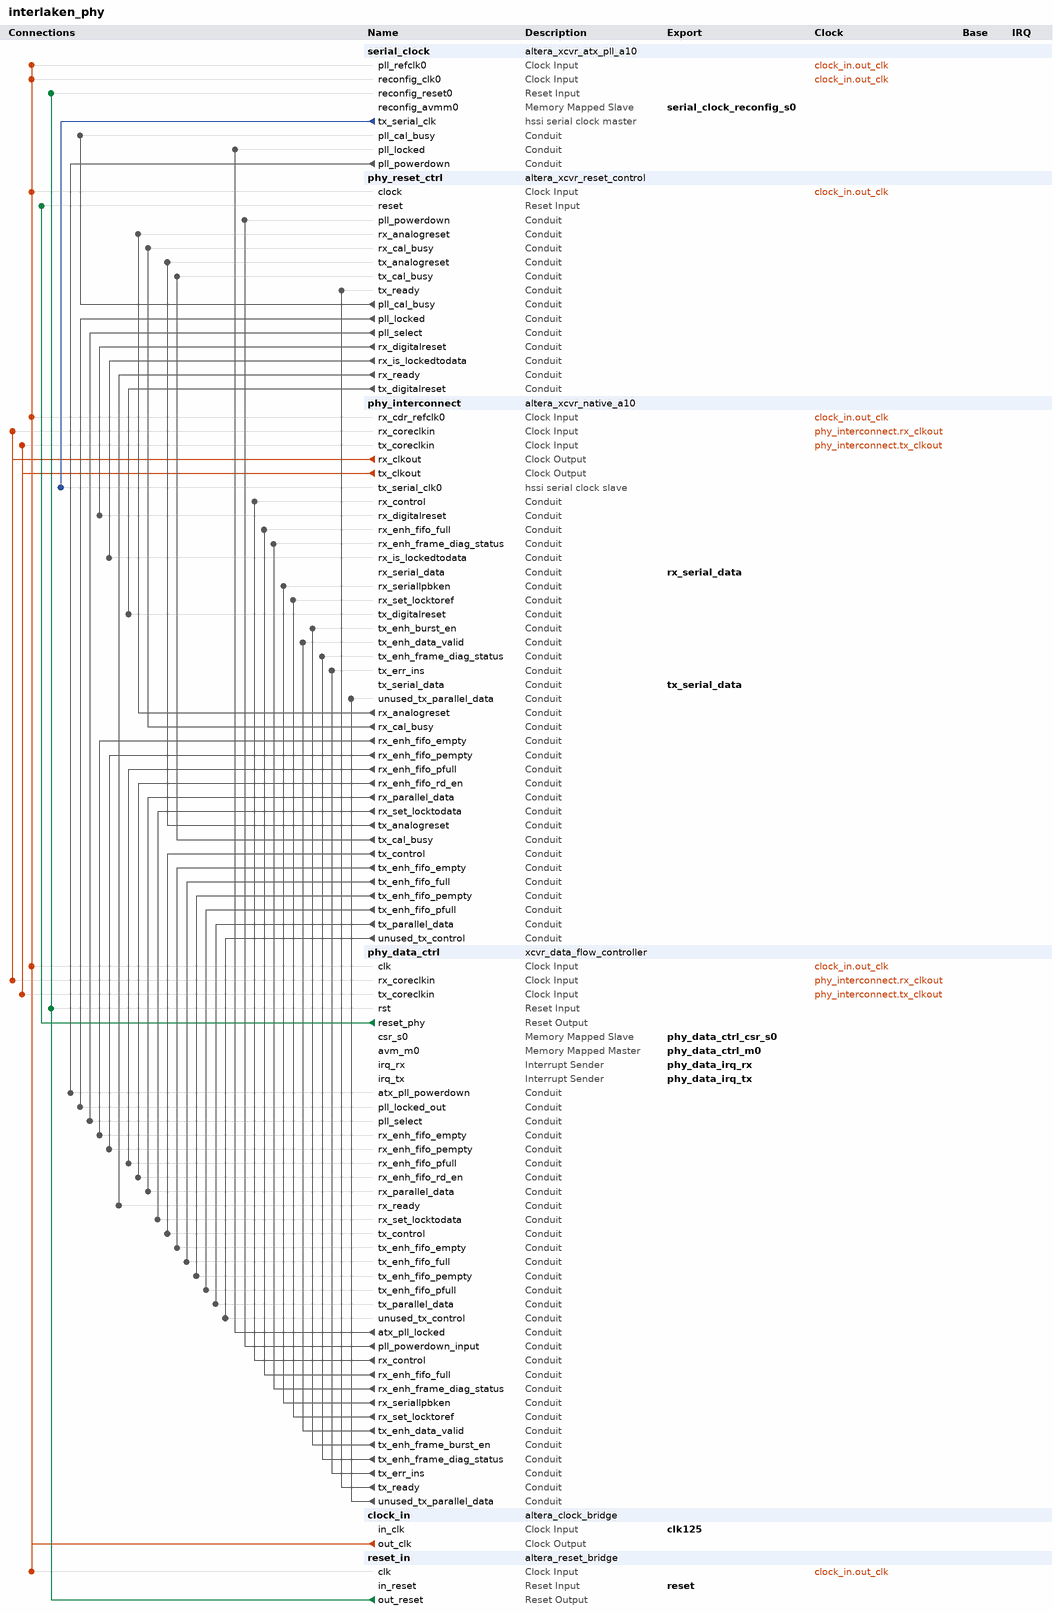
[diagram p0: system contents]
# Platform Designer (Qsys) system interlaken_phy, Cyclone 10 GX 10CX220YF780I5G
# Parameters at their usual value, and those the tool derives, are not listed.
package require -exact qsys 1.0
create_system interlaken_phy
set_project_property DEVICE_FAMILY {Cyclone 10 GX}
set_project_property DEVICE 10CX220YF780I5G

add_component serial_clock ip/interlaken_phy/interlaken_phy_xcvr_atx_pll_a10_0.ip altera_xcvr_atx_pll_a10 serial_clock 18.1

add_component phy_reset_ctrl ip/interlaken_phy/interlaken_phy_xcvr_reset_control_0.ip altera_xcvr_reset_control phy_reset_ctrl 18.1

add_component phy_interconnect ip/interlaken_phy/interlaken_phy_xcvr_native_a10_0.ip altera_xcvr_native_a10 phy_interconnect 18.1
load_component phy_interconnect
set_component_parameter_value device_family {Cyclone 10 GX}
set_component_parameter_value base_device NIGHTFURY1
set_component_parameter_value design_environment QSYS
set_component_parameter_value device_revision 20nm1
set_component_parameter_value anlg_voltage 0_9V
set_component_parameter_value protocol_mode interlaken_mode
set_component_parameter_value channels 1
set_component_parameter_value set_data_rate 1500
set_component_parameter_value rcfg_iface_enable 0
set_component_parameter_value enable_simple_interface 1
set_component_parameter_value enable_calibration 1
set_component_parameter_value set_disconnect_analog_resets 0
set_component_parameter_value enable_analog_resets 1
set_component_parameter_value enable_reset_sequence 1
set_component_parameter_value enable_upi_pipeline_options 0
set_component_parameter_value pcs_tx_delay1_ctrl delay1_path0
set_component_parameter_value pcs_tx_delay1_data_sel one_ff_delay
set_component_parameter_value pcs_tx_delay2_ctrl delay2_path0
set_component_parameter_value bonded_mode not_bonded
set_component_parameter_value pcs_bonding_master 0
set_component_parameter_value enable_port_tx_analog_reset_ack 0
set_component_parameter_value enable_port_tx_pma_clkout 0
set_component_parameter_value enable_port_tx_pma_div_clkout 0
set_component_parameter_value tx_pma_div_clkout_divider 0
set_component_parameter_value enable_port_rx_seriallpbken_tx 1
set_component_parameter_value set_cdr_refclk_freq 125.000
set_component_parameter_value enable_port_rx_analog_reset_ack 0
set_component_parameter_value enable_port_rx_pma_clkout 0
set_component_parameter_value enable_port_rx_pma_div_clkout 0
set_component_parameter_value rx_pma_div_clkout_divider 0
set_component_parameter_value enable_ports_rx_manual_cdr_mode 1
set_component_parameter_value std_pcs_pma_width 10
set_component_parameter_value display_std_tx_pld_pcs_width 10
set_component_parameter_value display_std_rx_pld_pcs_width 10
set_component_parameter_value enable_skp_ports 0
set_component_parameter_value hip_cal_en disable
set_component_parameter_value enable_pcie_data_mask_option 0
set_component_parameter_value std_data_mask_count_multi 0
set_component_parameter_value std_tx_byte_ser_mode Disabled
set_component_parameter_value std_rx_byte_deser_mode Disabled
set_component_parameter_value std_tx_8b10b_enable 0
set_component_parameter_value std_rx_8b10b_enable 0
set_component_parameter_value std_rx_word_aligner_mode bitslip
set_component_parameter_value std_rx_word_aligner_pattern_len 7
set_component_parameter_value enable_port_rx_std_bitslip 0
set_component_parameter_value std_tx_polinv_enable 0
set_component_parameter_value enable_port_tx_polinv 0
set_component_parameter_value std_rx_polinv_enable 0
set_component_parameter_value enable_port_rx_polinv 0
set_component_parameter_value enh_pcs_pma_width 40
set_component_parameter_value enh_pld_pcs_width 67
set_component_parameter_value enh_txfifo_mode Interlaken
set_component_parameter_value enable_port_tx_enh_fifo_full 1
set_component_parameter_value enable_port_tx_enh_fifo_pfull 1
set_component_parameter_value enable_port_tx_enh_fifo_empty 1
set_component_parameter_value enable_port_tx_enh_fifo_pempty 1
set_component_parameter_value enh_rxfifo_mode Interlaken
set_component_parameter_value enable_port_rx_enh_data_valid 0
set_component_parameter_value enable_port_rx_enh_fifo_full 1
set_component_parameter_value enable_port_rx_enh_fifo_pfull 1
set_component_parameter_value enable_port_rx_enh_fifo_empty 1
set_component_parameter_value enable_port_rx_enh_fifo_pempty 1
set_component_parameter_value enable_port_rx_enh_fifo_rd_en 1
set_component_parameter_value enh_tx_frmgen_enable 1
set_component_parameter_value enh_tx_frmgen_mfrm_length 5
set_component_parameter_value enh_tx_frmgen_burst_enable 1
set_component_parameter_value enable_port_tx_enh_frame_diag_status 1
set_component_parameter_value enable_port_tx_enh_frame_burst_en 1
set_component_parameter_value enh_rx_frmsync_enable 1
set_component_parameter_value enh_rx_frmsync_mfrm_length 5
set_component_parameter_value enable_port_rx_enh_frame_diag_status 1
set_component_parameter_value enh_tx_crcgen_enable 1
set_component_parameter_value enh_tx_crcerr_enable 1
set_component_parameter_value enh_rx_crcchk_enable 1
set_component_parameter_value enable_port_rx_enh_clr_errblk_count 0
set_component_parameter_value enable_port_rx_enh_clr_errblk_count_c10 0
set_component_parameter_value enh_tx_scram_enable 1
set_component_parameter_value enh_tx_scram_seed 81985529216486895
set_component_parameter_value enh_rx_descram_enable 1
set_component_parameter_value enh_tx_dispgen_enable 1
set_component_parameter_value enh_rx_dispchk_enable 1
set_component_parameter_value enh_rx_blksync_enable 1
set_component_parameter_value enable_port_rx_enh_blk_lock 0
set_component_parameter_value enable_port_rx_enh_bitslip 0
set_component_parameter_value generate_docs 0
set_component_parameter_value generate_add_hdl_instance_example 0
set_component_parameter_value enable_advanced_options 0
set_component_parameter_value enable_physical_bonding_clocks 0
set_component_parameter_value enable_debug_options 0
set_component_parameter_value enable_advanced_avmm_options 0
set_component_parameter_value enable_odi_accelerator 0
set_component_parameter_value enable_advanced_upi_options 0
set_component_parameter_value l_channels 1
set_component_parameter_value tx_enable 1
set_component_parameter_value datapath_select Enhanced
set_component_parameter_value rx_enable 1
set_component_parameter_value l_split_iface 0
set_component_parameter_value l_pcs_pma_width 40
set_component_parameter_value l_tx_pld_pcs_width 67
set_component_parameter_value l_rx_pld_pcs_width 67
set_component_parameter_value l_pll_settings_key 125.000000
set_component_parameter_value l_enable_pma_bonding 0
set_component_parameter_value l_enable_reve_support 0
set_component_parameter_value enable_std 0
set_component_parameter_value l_enable_std_pipe 0
set_component_parameter_value l_enable_tx_std 0
set_component_parameter_value l_enable_rx_std 0
set_component_parameter_value l_enable_tx_std_iface 0
set_component_parameter_value l_enable_rx_std_iface 0
set_component_parameter_value l_std_tx_word_count 1
set_component_parameter_value l_std_tx_word_width 10
set_component_parameter_value l_std_tx_field_width 11
set_component_parameter_value l_std_rx_word_count 1
set_component_parameter_value l_std_rx_word_width 10
set_component_parameter_value l_std_rx_field_width 16
set_component_parameter_value l_std_tx_pld_pcs_width 10
set_component_parameter_value l_std_rx_pld_pcs_width 10
set_component_parameter_value l_std_data_mask_count_multi 0
set_component_parameter_value enable_enh 1
set_component_parameter_value l_enable_tx_enh 1
set_component_parameter_value l_enable_rx_enh 1
set_component_parameter_value l_enable_tx_enh_iface 1
set_component_parameter_value l_enable_rx_enh_iface 1
set_component_parameter_value enable_pcs_dir 0
set_component_parameter_value l_enable_tx_pcs_dir 0
set_component_parameter_value l_enable_rx_pcs_dir 0
set_component_parameter_value l_rcfg_ifaces 1
set_component_parameter_value l_rcfg_addr_bits 10
set_component_parameter_value is_c10 1
set_component_parameter_value rcfg_enable 0
set_component_parameter_value rcfg_shared 0
set_component_parameter_value rcfg_jtag_enable 0
set_component_parameter_value rcfg_separate_avmm_busy 0
set_component_parameter_value adme_prot_mode interlaken_mode
set_component_parameter_value adme_pma_mode basic
set_component_parameter_value adme_tx_power_mode low_power
set_component_parameter_value adme_data_rate 1500000000
set_component_parameter_value enable_pcie_dfe_ip false
set_component_parameter_value sim_reduced_counters false
set_component_parameter_value disable_continuous_dfe false
set_component_parameter_value set_capability_reg_enable 0
set_component_parameter_value set_csr_soft_logic_enable 0
set_component_parameter_value set_prbs_soft_logic_enable 0
set_component_parameter_value set_odi_soft_logic_enable 0
set_component_parameter_value dbg_embedded_debug_enable 0
set_component_parameter_value dbg_capability_reg_enable 0
set_component_parameter_value dbg_user_identifier 0
set_component_parameter_value dbg_stat_soft_logic_enable 0
set_component_parameter_value dbg_ctrl_soft_logic_enable 0
set_component_parameter_value dbg_prbs_soft_logic_enable 0
set_component_parameter_value dbg_odi_soft_logic_enable 0
set_component_parameter_value rcfg_file_prefix altera_xcvr_native_a10
set_component_parameter_value rcfg_sv_file_enable 0
set_component_parameter_value rcfg_h_file_enable 0
set_component_parameter_value rcfg_mif_file_enable 0
set_component_parameter_value rcfg_multi_enable 0
set_component_parameter_value rcfg_emb_strm_enable 0
set_component_parameter_value rcfg_reduced_files_enable 0
set_component_parameter_value rcfg_profile_cnt 2
set_component_parameter_value rcfg_profile_select 1
set_component_parameter_value l_rcfg_datapath_message 0
set_component_parameter_value l_anlg_tx_enable 0
set_component_parameter_value l_anlg_rx_enable 0
set_component_parameter_value hssi_gen3_rx_pcs_block_sync bypass_block_sync
set_component_parameter_value hssi_gen3_rx_pcs_block_sync_sm disable_blk_sync_sm
set_component_parameter_value hssi_gen3_rx_pcs_cdr_ctrl_force_unalgn disable
set_component_parameter_value hssi_gen3_rx_pcs_lpbk_force lpbk_frce_dis
set_component_parameter_value hssi_gen3_rx_pcs_mode disable_pcs
set_component_parameter_value hssi_gen3_rx_pcs_rate_match_fifo bypass_rm_fifo
set_component_parameter_value hssi_gen3_rx_pcs_rate_match_fifo_latency low_latency
set_component_parameter_value hssi_gen3_rx_pcs_reverse_lpbk rev_lpbk_dis
set_component_parameter_value hssi_gen3_rx_pcs_rx_b4gb_par_lpbk b4gb_par_lpbk_dis
set_component_parameter_value hssi_gen3_rx_pcs_rx_force_balign dis_force_balign
set_component_parameter_value hssi_gen3_rx_pcs_rx_ins_del_one_skip ins_del_one_skip_dis
set_component_parameter_value hssi_gen3_rx_pcs_rx_num_fixed_pat 0
set_component_parameter_value hssi_gen3_rx_pcs_rx_test_out_sel rx_test_out0
set_component_parameter_value hssi_gen3_rx_pcs_sup_mode user_mode
set_component_parameter_value hssi_gen3_rx_pcs_silicon_rev 20nm5es
set_component_parameter_value hssi_gen3_rx_pcs_reconfig_settings {{}}
set_component_parameter_value hssi_gen3_tx_pcs_mode disable_pcs
set_component_parameter_value hssi_gen3_tx_pcs_reverse_lpbk rev_lpbk_dis
set_component_parameter_value hssi_gen3_tx_pcs_sup_mode user_mode
set_component_parameter_value hssi_gen3_tx_pcs_tx_bitslip 0
set_component_parameter_value hssi_gen3_tx_pcs_tx_gbox_byp bypass_gbox
set_component_parameter_value hssi_gen3_tx_pcs_silicon_rev 20nm5es
set_component_parameter_value hssi_krfec_rx_pcs_blksync_cor_en detect
set_component_parameter_value hssi_krfec_rx_pcs_bypass_gb bypass_dis
set_component_parameter_value hssi_krfec_rx_pcs_clr_ctrl both_enabled
set_component_parameter_value hssi_krfec_rx_pcs_ctrl_bit_reverse ctrl_bit_reverse_en
set_component_parameter_value hssi_krfec_rx_pcs_data_bit_reverse data_bit_reverse_dis
set_component_parameter_value hssi_krfec_rx_pcs_dv_start with_blklock
set_component_parameter_value hssi_krfec_rx_pcs_err_mark_type err_mark_10g
set_component_parameter_value hssi_krfec_rx_pcs_error_marking_en err_mark_dis
set_component_parameter_value hssi_krfec_rx_pcs_low_latency_en disable
set_component_parameter_value hssi_krfec_rx_pcs_lpbk_mode lpbk_dis
set_component_parameter_value hssi_krfec_rx_pcs_parity_invalid_enum 8
set_component_parameter_value hssi_krfec_rx_pcs_parity_valid_num 4
set_component_parameter_value hssi_krfec_rx_pcs_pipeln_blksync enable
set_component_parameter_value hssi_krfec_rx_pcs_pipeln_descrm disable
set_component_parameter_value hssi_krfec_rx_pcs_pipeln_errcorrect disable
set_component_parameter_value hssi_krfec_rx_pcs_pipeln_errtrap_ind enable
set_component_parameter_value hssi_krfec_rx_pcs_pipeln_errtrap_lfsr disable
set_component_parameter_value hssi_krfec_rx_pcs_pipeln_errtrap_loc disable
set_component_parameter_value hssi_krfec_rx_pcs_pipeln_errtrap_pat disable
set_component_parameter_value hssi_krfec_rx_pcs_pipeln_gearbox enable
set_component_parameter_value hssi_krfec_rx_pcs_pipeln_syndrm enable
set_component_parameter_value hssi_krfec_rx_pcs_pipeln_trans_dec disable
set_component_parameter_value hssi_krfec_rx_pcs_prot_mode disable_mode
set_component_parameter_value hssi_krfec_rx_pcs_receive_order receive_lsb
set_component_parameter_value hssi_krfec_rx_pcs_rx_testbus_sel overall
set_component_parameter_value hssi_krfec_rx_pcs_signal_ok_en sig_ok_en
set_component_parameter_value hssi_krfec_rx_pcs_sup_mode user_mode
set_component_parameter_value hssi_krfec_rx_pcs_silicon_rev 20nm5es
set_component_parameter_value hssi_krfec_rx_pcs_reconfig_settings {{}}
set_component_parameter_value hssi_krfec_tx_pcs_burst_err burst_err_dis
set_component_parameter_value hssi_krfec_tx_pcs_burst_err_len burst_err_len1
set_component_parameter_value hssi_krfec_tx_pcs_ctrl_bit_reverse ctrl_bit_reverse_en
set_component_parameter_value hssi_krfec_tx_pcs_data_bit_reverse data_bit_reverse_dis
set_component_parameter_value hssi_krfec_tx_pcs_enc_frame_query enc_query_dis
set_component_parameter_value hssi_krfec_tx_pcs_low_latency_en disable
set_component_parameter_value hssi_krfec_tx_pcs_pipeln_encoder enable
set_component_parameter_value hssi_krfec_tx_pcs_pipeln_scrambler enable
set_component_parameter_value hssi_krfec_tx_pcs_prot_mode disable_mode
set_component_parameter_value hssi_krfec_tx_pcs_sup_mode user_mode
set_component_parameter_value hssi_krfec_tx_pcs_transcode_err trans_err_dis
set_component_parameter_value hssi_krfec_tx_pcs_transmit_order transmit_lsb
set_component_parameter_value hssi_krfec_tx_pcs_tx_testbus_sel overall
set_component_parameter_value hssi_krfec_tx_pcs_silicon_rev 20nm5es
set_component_parameter_value hssi_10g_rx_pcs_align_del align_del_dis
set_component_parameter_value hssi_10g_rx_pcs_ber_bit_err_total_cnt bit_err_total_cnt_10g
set_component_parameter_value hssi_10g_rx_pcs_ber_clken ber_clk_dis
set_component_parameter_value hssi_10g_rx_pcs_ber_xus_timer_window 19530
set_component_parameter_value hssi_10g_rx_pcs_bitslip_mode bitslip_dis
set_component_parameter_value hssi_10g_rx_pcs_blksync_bitslip_type bitslip_comb
set_component_parameter_value hssi_10g_rx_pcs_blksync_bitslip_wait_cnt 1
set_component_parameter_value hssi_10g_rx_pcs_blksync_bitslip_wait_type bitslip_cnt
set_component_parameter_value hssi_10g_rx_pcs_blksync_bypass blksync_bypass_dis
set_component_parameter_value hssi_10g_rx_pcs_blksync_clken blksync_clk_en
set_component_parameter_value hssi_10g_rx_pcs_blksync_enum_invalid_sh_cnt enum_invalid_sh_cnt_10g
set_component_parameter_value hssi_10g_rx_pcs_blksync_knum_sh_cnt_postlock knum_sh_cnt_postlock_10g
set_component_parameter_value hssi_10g_rx_pcs_blksync_knum_sh_cnt_prelock knum_sh_cnt_prelock_10g
set_component_parameter_value hssi_10g_rx_pcs_blksync_pipeln blksync_pipeln_dis
set_component_parameter_value hssi_10g_rx_pcs_clr_errblk_cnt_en disable
set_component_parameter_value hssi_10g_rx_pcs_control_del control_del_none
set_component_parameter_value hssi_10g_rx_pcs_crcchk_bypass crcchk_bypass_dis
set_component_parameter_value hssi_10g_rx_pcs_crcchk_clken crcchk_clk_en
set_component_parameter_value hssi_10g_rx_pcs_crcchk_inv crcchk_inv_en
set_component_parameter_value hssi_10g_rx_pcs_crcchk_pipeln crcchk_pipeln_dis
set_component_parameter_value hssi_10g_rx_pcs_crcflag_pipeln crcflag_pipeln_en
set_component_parameter_value hssi_10g_rx_pcs_ctrl_bit_reverse ctrl_bit_reverse_en
set_component_parameter_value hssi_10g_rx_pcs_data_bit_reverse data_bit_reverse_en
set_component_parameter_value hssi_10g_rx_pcs_dec_64b66b_rxsm_bypass dec_64b66b_rxsm_bypass_en
set_component_parameter_value hssi_10g_rx_pcs_dec64b66b_clken dec64b66b_clk_dis
set_component_parameter_value hssi_10g_rx_pcs_descrm_bypass descrm_bypass_dis
set_component_parameter_value hssi_10g_rx_pcs_descrm_clken descrm_clk_en
set_component_parameter_value hssi_10g_rx_pcs_descrm_mode sync
set_component_parameter_value hssi_10g_rx_pcs_descrm_pipeln enable
set_component_parameter_value hssi_10g_rx_pcs_dft_clk_out_sel rx_master_clk
set_component_parameter_value hssi_10g_rx_pcs_dis_signal_ok dis_signal_ok_en
set_component_parameter_value hssi_10g_rx_pcs_dispchk_bypass dispchk_bypass_dis
set_component_parameter_value hssi_10g_rx_pcs_empty_flag_type empty_rd_side
set_component_parameter_value hssi_10g_rx_pcs_fast_path fast_path_dis
set_component_parameter_value hssi_10g_rx_pcs_fec_clken fec_clk_dis
set_component_parameter_value hssi_10g_rx_pcs_fec_enable fec_dis
set_component_parameter_value hssi_10g_rx_pcs_fifo_double_read fifo_double_read_dis
set_component_parameter_value hssi_10g_rx_pcs_fifo_stop_rd n_rd_empty
set_component_parameter_value hssi_10g_rx_pcs_fifo_stop_wr n_wr_full
set_component_parameter_value hssi_10g_rx_pcs_force_align force_align_dis
set_component_parameter_value hssi_10g_rx_pcs_frmsync_bypass frmsync_bypass_dis
set_component_parameter_value hssi_10g_rx_pcs_frmsync_clken frmsync_clk_en
set_component_parameter_value hssi_10g_rx_pcs_frmsync_enum_scrm enum_scrm_default
set_component_parameter_value hssi_10g_rx_pcs_frmsync_enum_sync enum_sync_default
set_component_parameter_value hssi_10g_rx_pcs_frmsync_flag_type location_only
set_component_parameter_value hssi_10g_rx_pcs_frmsync_knum_sync knum_sync_default
set_component_parameter_value hssi_10g_rx_pcs_frmsync_mfrm_length 5
set_component_parameter_value hssi_10g_rx_pcs_frmsync_pipeln frmsync_pipeln_en
set_component_parameter_value hssi_10g_rx_pcs_full_flag_type full_wr_side
set_component_parameter_value hssi_10g_rx_pcs_gb_rx_idwidth width_40
set_component_parameter_value hssi_10g_rx_pcs_gb_rx_odwidth width_67
set_component_parameter_value hssi_10g_rx_pcs_gbexp_clken gbexp_clk_en
set_component_parameter_value hssi_10g_rx_pcs_low_latency_en disable
set_component_parameter_value hssi_10g_rx_pcs_lpbk_mode lpbk_dis
set_component_parameter_value hssi_10g_rx_pcs_master_clk_sel master_rx_pma_clk
set_component_parameter_value hssi_10g_rx_pcs_pempty_flag_type pempty_rd_side
set_component_parameter_value hssi_10g_rx_pcs_pfull_flag_type pfull_wr_side
set_component_parameter_value hssi_10g_rx_pcs_phcomp_rd_del phcomp_rd_del2
set_component_parameter_value hssi_10g_rx_pcs_pld_if_type fifo
set_component_parameter_value hssi_10g_rx_pcs_prot_mode interlaken_mode
set_component_parameter_value hssi_10g_rx_pcs_rand_clken rand_clk_dis
set_component_parameter_value hssi_10g_rx_pcs_rd_clk_sel rd_rx_pld_clk
set_component_parameter_value hssi_10g_rx_pcs_rdfifo_clken rdfifo_clk_en
set_component_parameter_value hssi_10g_rx_pcs_rx_fifo_write_ctrl blklock_stops
set_component_parameter_value hssi_10g_rx_pcs_rx_scrm_width bit64
set_component_parameter_value hssi_10g_rx_pcs_rx_sh_location lsb
set_component_parameter_value hssi_10g_rx_pcs_rx_signal_ok_sel synchronized_ver
set_component_parameter_value hssi_10g_rx_pcs_rx_sm_bypass rx_sm_bypass_en
set_component_parameter_value hssi_10g_rx_pcs_rx_sm_hiber rx_sm_hiber_en
set_component_parameter_value hssi_10g_rx_pcs_rx_sm_pipeln rx_sm_pipeln_en
set_component_parameter_value hssi_10g_rx_pcs_rx_testbus_sel rx_fifo_testbus1
set_component_parameter_value hssi_10g_rx_pcs_rx_true_b2b b2b
set_component_parameter_value hssi_10g_rx_pcs_rxfifo_empty empty_default
set_component_parameter_value hssi_10g_rx_pcs_rxfifo_full full_default
set_component_parameter_value hssi_10g_rx_pcs_rxfifo_mode generic_interlaken
set_component_parameter_value hssi_10g_rx_pcs_rxfifo_pempty 2
set_component_parameter_value hssi_10g_rx_pcs_rxfifo_pfull 23
set_component_parameter_value hssi_10g_rx_pcs_stretch_num_stages one_stage
set_component_parameter_value hssi_10g_rx_pcs_sup_mode user_mode
set_component_parameter_value hssi_10g_rx_pcs_test_mode test_off
set_component_parameter_value hssi_10g_rx_pcs_wrfifo_clken wrfifo_clk_en
set_component_parameter_value hssi_10g_rx_pcs_advanced_user_mode disable
set_component_parameter_value hssi_10g_rx_pcs_silicon_rev 20nm5es
set_component_parameter_value hssi_10g_rx_pcs_reconfig_settings {{}}
set_component_parameter_value hssi_10g_tx_pcs_bitslip_en bitslip_dis
set_component_parameter_value hssi_10g_tx_pcs_bonding_dft_en dft_dis
set_component_parameter_value hssi_10g_tx_pcs_bonding_dft_val dft_0
set_component_parameter_value hssi_10g_tx_pcs_comp_cnt 0
set_component_parameter_value hssi_10g_tx_pcs_compin_sel compin_master
set_component_parameter_value hssi_10g_tx_pcs_crcgen_bypass crcgen_bypass_dis
set_component_parameter_value hssi_10g_tx_pcs_crcgen_clken crcgen_clk_en
set_component_parameter_value hssi_10g_tx_pcs_crcgen_err crcgen_err_en
set_component_parameter_value hssi_10g_tx_pcs_crcgen_inv crcgen_inv_en
set_component_parameter_value hssi_10g_tx_pcs_ctrl_bit_reverse ctrl_bit_reverse_en
set_component_parameter_value hssi_10g_tx_pcs_ctrl_plane_bonding individual
set_component_parameter_value hssi_10g_tx_pcs_data_bit_reverse data_bit_reverse_en
set_component_parameter_value hssi_10g_tx_pcs_dft_clk_out_sel tx_master_clk
set_component_parameter_value hssi_10g_tx_pcs_dispgen_bypass dispgen_bypass_dis
set_component_parameter_value hssi_10g_tx_pcs_dispgen_clken dispgen_clk_en
set_component_parameter_value hssi_10g_tx_pcs_dispgen_err dispgen_err_dis
set_component_parameter_value hssi_10g_tx_pcs_dispgen_pipeln dispgen_pipeln_dis
set_component_parameter_value hssi_10g_tx_pcs_distdwn_bypass_pipeln distdwn_bypass_pipeln_dis
set_component_parameter_value hssi_10g_tx_pcs_distdwn_master distdwn_master_en
set_component_parameter_value hssi_10g_tx_pcs_distup_bypass_pipeln distup_bypass_pipeln_dis
set_component_parameter_value hssi_10g_tx_pcs_distup_master distup_master_en
set_component_parameter_value hssi_10g_tx_pcs_dv_bond dv_bond_dis
set_component_parameter_value hssi_10g_tx_pcs_empty_flag_type empty_rd_side
set_component_parameter_value hssi_10g_tx_pcs_enc_64b66b_txsm_bypass enc_64b66b_txsm_bypass_en
set_component_parameter_value hssi_10g_tx_pcs_enc64b66b_txsm_clken enc64b66b_txsm_clk_dis
set_component_parameter_value hssi_10g_tx_pcs_fastpath fastpath_dis
set_component_parameter_value hssi_10g_tx_pcs_fec_clken fec_clk_dis
set_component_parameter_value hssi_10g_tx_pcs_fec_enable fec_dis
set_component_parameter_value hssi_10g_tx_pcs_fifo_double_write fifo_double_write_dis
set_component_parameter_value hssi_10g_tx_pcs_fifo_reg_fast fifo_reg_fast_dis
set_component_parameter_value hssi_10g_tx_pcs_fifo_stop_rd n_rd_empty
set_component_parameter_value hssi_10g_tx_pcs_fifo_stop_wr n_wr_full
set_component_parameter_value hssi_10g_tx_pcs_frmgen_burst frmgen_burst_en
set_component_parameter_value hssi_10g_tx_pcs_frmgen_bypass frmgen_bypass_dis
set_component_parameter_value hssi_10g_tx_pcs_frmgen_clken frmgen_clk_en
set_component_parameter_value hssi_10g_tx_pcs_frmgen_mfrm_length 5
set_component_parameter_value hssi_10g_tx_pcs_frmgen_pipeln frmgen_pipeln_en
set_component_parameter_value hssi_10g_tx_pcs_frmgen_pyld_ins frmgen_pyld_ins_dis
set_component_parameter_value hssi_10g_tx_pcs_frmgen_wordslip frmgen_wordslip_dis
set_component_parameter_value hssi_10g_tx_pcs_full_flag_type full_wr_side
set_component_parameter_value hssi_10g_tx_pcs_gb_pipeln_bypass disable
set_component_parameter_value hssi_10g_tx_pcs_gb_tx_idwidth width_67
set_component_parameter_value hssi_10g_tx_pcs_gb_tx_odwidth width_40
set_component_parameter_value hssi_10g_tx_pcs_gbred_clken gbred_clk_en
set_component_parameter_value hssi_10g_tx_pcs_indv indv_en
set_component_parameter_value hssi_10g_tx_pcs_low_latency_en disable
set_component_parameter_value hssi_10g_tx_pcs_master_clk_sel master_tx_pma_clk
set_component_parameter_value hssi_10g_tx_pcs_pempty_flag_type pempty_rd_side
set_component_parameter_value hssi_10g_tx_pcs_pfull_flag_type pfull_wr_side
set_component_parameter_value hssi_10g_tx_pcs_phcomp_rd_del phcomp_rd_del2
set_component_parameter_value hssi_10g_tx_pcs_pld_if_type fifo
set_component_parameter_value hssi_10g_tx_pcs_prot_mode interlaken_mode
set_component_parameter_value hssi_10g_tx_pcs_pseudo_random all_0
set_component_parameter_value hssi_10g_tx_pcs_pseudo_seed_a 81985529216486895
set_component_parameter_value hssi_10g_tx_pcs_pseudo_seed_b 288230376151711743
set_component_parameter_value hssi_10g_tx_pcs_random_disp disable
set_component_parameter_value hssi_10g_tx_pcs_rdfifo_clken rdfifo_clk_en
set_component_parameter_value hssi_10g_tx_pcs_scrm_bypass scrm_bypass_dis
set_component_parameter_value hssi_10g_tx_pcs_scrm_clken scrm_clk_en
set_component_parameter_value hssi_10g_tx_pcs_scrm_mode sync
set_component_parameter_value hssi_10g_tx_pcs_scrm_pipeln enable
set_component_parameter_value hssi_10g_tx_pcs_sh_err sh_err_dis
set_component_parameter_value hssi_10g_tx_pcs_sop_mark sop_mark_dis
set_component_parameter_value hssi_10g_tx_pcs_stretch_num_stages one_stage
set_component_parameter_value hssi_10g_tx_pcs_sup_mode user_mode
set_component_parameter_value hssi_10g_tx_pcs_test_mode test_off
set_component_parameter_value hssi_10g_tx_pcs_tx_scrm_err scrm_err_dis
set_component_parameter_value hssi_10g_tx_pcs_tx_scrm_width bit64
set_component_parameter_value hssi_10g_tx_pcs_tx_sh_location lsb
set_component_parameter_value hssi_10g_tx_pcs_tx_sm_bypass tx_sm_bypass_en
set_component_parameter_value hssi_10g_tx_pcs_tx_sm_pipeln tx_sm_pipeln_en
set_component_parameter_value hssi_10g_tx_pcs_tx_testbus_sel tx_fifo_testbus1
set_component_parameter_value hssi_10g_tx_pcs_txfifo_empty empty_default
set_component_parameter_value hssi_10g_tx_pcs_txfifo_full full_default
set_component_parameter_value hssi_10g_tx_pcs_txfifo_mode interlaken_generic
set_component_parameter_value hssi_10g_tx_pcs_txfifo_pempty 2
set_component_parameter_value hssi_10g_tx_pcs_txfifo_pfull 11
set_component_parameter_value hssi_10g_tx_pcs_wr_clk_sel wr_tx_pld_clk
set_component_parameter_value hssi_10g_tx_pcs_wrfifo_clken wrfifo_clk_en
set_component_parameter_value hssi_10g_tx_pcs_advanced_user_mode enable
set_component_parameter_value hssi_10g_tx_pcs_silicon_rev 20nm5es
set_component_parameter_value hssi_10g_tx_pcs_reconfig_settings {{}}
set_component_parameter_value hssi_8g_rx_pcs_auto_error_replacement dis_err_replace
set_component_parameter_value hssi_8g_rx_pcs_auto_speed_nego dis_asn
set_component_parameter_value hssi_8g_rx_pcs_bit_reversal dis_bit_reversal
set_component_parameter_value hssi_8g_rx_pcs_bonding_dft_en dft_dis
set_component_parameter_value hssi_8g_rx_pcs_bonding_dft_val dft_0
set_component_parameter_value hssi_8g_rx_pcs_bypass_pipeline_reg dis_bypass_pipeline
set_component_parameter_value hssi_8g_rx_pcs_byte_deserializer dis_bds
set_component_parameter_value hssi_8g_rx_pcs_cdr_ctrl_rxvalid_mask dis_rxvalid_mask
set_component_parameter_value hssi_8g_rx_pcs_clkcmp_pattern_n 0
set_component_parameter_value hssi_8g_rx_pcs_clkcmp_pattern_p 0
set_component_parameter_value hssi_8g_rx_pcs_clock_gate_bds_dec_asn en_bds_dec_asn_clk_gating
set_component_parameter_value hssi_8g_rx_pcs_clock_gate_cdr_eidle en_cdr_eidle_clk_gating
set_component_parameter_value hssi_8g_rx_pcs_clock_gate_dw_pc_wrclk en_dw_pc_wrclk_gating
set_component_parameter_value hssi_8g_rx_pcs_clock_gate_dw_rm_rd en_dw_rm_rdclk_gating
set_component_parameter_value hssi_8g_rx_pcs_clock_gate_dw_rm_wr en_dw_rm_wrclk_gating
set_component_parameter_value hssi_8g_rx_pcs_clock_gate_dw_wa en_dw_wa_clk_gating
set_component_parameter_value hssi_8g_rx_pcs_clock_gate_pc_rdclk en_pc_rdclk_gating
set_component_parameter_value hssi_8g_rx_pcs_clock_gate_sw_pc_wrclk en_sw_pc_wrclk_gating
set_component_parameter_value hssi_8g_rx_pcs_clock_gate_sw_rm_rd en_sw_rm_rdclk_gating
set_component_parameter_value hssi_8g_rx_pcs_clock_gate_sw_rm_wr en_sw_rm_wrclk_gating
set_component_parameter_value hssi_8g_rx_pcs_clock_gate_sw_wa en_sw_wa_clk_gating
set_component_parameter_value hssi_8g_rx_pcs_clock_observation_in_pld_core internal_sw_wa_clk
set_component_parameter_value hssi_8g_rx_pcs_ctrl_plane_bonding_compensation dis_compensation
set_component_parameter_value hssi_8g_rx_pcs_ctrl_plane_bonding_consumption individual
set_component_parameter_value hssi_8g_rx_pcs_ctrl_plane_bonding_distribution not_master_chnl_distr
set_component_parameter_value hssi_8g_rx_pcs_eidle_entry_eios dis_eidle_eios
set_component_parameter_value hssi_8g_rx_pcs_eidle_entry_iei dis_eidle_iei
set_component_parameter_value hssi_8g_rx_pcs_eidle_entry_sd dis_eidle_sd
set_component_parameter_value hssi_8g_rx_pcs_eightb_tenb_decoder en_8b10b_ibm
set_component_parameter_value hssi_8g_rx_pcs_err_flags_sel err_flags_wa
set_component_parameter_value hssi_8g_rx_pcs_fixed_pat_det dis_fixed_patdet
set_component_parameter_value hssi_8g_rx_pcs_fixed_pat_num 0
set_component_parameter_value hssi_8g_rx_pcs_force_signal_detect en_force_signal_detect
set_component_parameter_value hssi_8g_rx_pcs_gen3_clk_en disable_clk
set_component_parameter_value hssi_8g_rx_pcs_gen3_rx_clk_sel rcvd_clk
set_component_parameter_value hssi_8g_rx_pcs_gen3_tx_clk_sel tx_pma_clk
set_component_parameter_value hssi_8g_rx_pcs_hip_mode dis_hip
set_component_parameter_value hssi_8g_rx_pcs_ibm_invalid_code dis_ibm_invalid_code
set_component_parameter_value hssi_8g_rx_pcs_invalid_code_flag_only dis_invalid_code_only
set_component_parameter_value hssi_8g_rx_pcs_pad_or_edb_error_replace replace_edb
set_component_parameter_value hssi_8g_rx_pcs_pcs_bypass dis_pcs_bypass
set_component_parameter_value hssi_8g_rx_pcs_phase_comp_rdptr disable_rdptr
set_component_parameter_value hssi_8g_rx_pcs_phase_compensation_fifo low_latency
set_component_parameter_value hssi_8g_rx_pcs_pipe_if_enable dis_pipe_rx
set_component_parameter_value hssi_8g_rx_pcs_pma_dw ten_bit
set_component_parameter_value hssi_8g_rx_pcs_polinv_8b10b_dec dis_polinv_8b10b_dec
set_component_parameter_value hssi_8g_rx_pcs_prot_mode disabled_prot_mode
set_component_parameter_value hssi_8g_rx_pcs_rate_match dis_rm
set_component_parameter_value hssi_8g_rx_pcs_rate_match_del_thres dis_rm_del_thres
set_component_parameter_value hssi_8g_rx_pcs_rate_match_empty_thres dis_rm_empty_thres
set_component_parameter_value hssi_8g_rx_pcs_rate_match_full_thres dis_rm_full_thres
set_component_parameter_value hssi_8g_rx_pcs_rate_match_ins_thres dis_rm_ins_thres
set_component_parameter_value hssi_8g_rx_pcs_rate_match_start_thres dis_rm_start_thres
set_component_parameter_value hssi_8g_rx_pcs_rx_clk_free_running en_rx_clk_free_run
set_component_parameter_value hssi_8g_rx_pcs_rx_clk2 rcvd_clk_clk2
set_component_parameter_value hssi_8g_rx_pcs_rx_pcs_urst en_rx_pcs_urst
set_component_parameter_value hssi_8g_rx_pcs_rx_rcvd_clk rcvd_clk_rcvd_clk
set_component_parameter_value hssi_8g_rx_pcs_rx_rd_clk pld_rx_clk
set_component_parameter_value hssi_8g_rx_pcs_rx_refclk dis_refclk_sel
set_component_parameter_value hssi_8g_rx_pcs_rx_wr_clk rx_clk2_div_1_2_4
set_component_parameter_value hssi_8g_rx_pcs_sup_mode user_mode
set_component_parameter_value hssi_8g_rx_pcs_symbol_swap dis_symbol_swap
set_component_parameter_value hssi_8g_rx_pcs_sync_sm_idle_eios dis_syncsm_idle
set_component_parameter_value hssi_8g_rx_pcs_test_bus_sel tx_testbus
set_component_parameter_value hssi_8g_rx_pcs_tx_rx_parallel_loopback dis_plpbk
set_component_parameter_value hssi_8g_rx_pcs_wa_boundary_lock_ctrl sync_sm
set_component_parameter_value hssi_8g_rx_pcs_wa_clk_slip_spacing 16
set_component_parameter_value hssi_8g_rx_pcs_wa_det_latency_sync_status_beh dont_care_assert_sync
set_component_parameter_value hssi_8g_rx_pcs_wa_disp_err_flag en_disp_err_flag
set_component_parameter_value hssi_8g_rx_pcs_wa_kchar dis_kchar
set_component_parameter_value hssi_8g_rx_pcs_wa_pd wa_pd_10
set_component_parameter_value hssi_8g_rx_pcs_wa_pd_data 0
set_component_parameter_value hssi_8g_rx_pcs_wa_pd_polarity dont_care_both_pol
set_component_parameter_value hssi_8g_rx_pcs_wa_pld_controlled dis_pld_ctrl
set_component_parameter_value hssi_8g_rx_pcs_wa_renumber_data 3
set_component_parameter_value hssi_8g_rx_pcs_wa_rgnumber_data 3
set_component_parameter_value hssi_8g_rx_pcs_wa_rknumber_data 3
set_component_parameter_value hssi_8g_rx_pcs_wa_rosnumber_data 1
set_component_parameter_value hssi_8g_rx_pcs_wa_rvnumber_data 0
set_component_parameter_value hssi_8g_rx_pcs_wa_sync_sm_ctrl gige_sync_sm
set_component_parameter_value hssi_8g_rx_pcs_wait_cnt 0
set_component_parameter_value hssi_8g_rx_pcs_silicon_rev 20nm5es
set_component_parameter_value hssi_8g_rx_pcs_reconfig_settings {{}}
set_component_parameter_value hssi_8g_tx_pcs_auto_speed_nego_gen2 dis_asn_g2
set_component_parameter_value hssi_8g_tx_pcs_bit_reversal dis_bit_reversal
set_component_parameter_value hssi_8g_tx_pcs_bonding_dft_en dft_dis
set_component_parameter_value hssi_8g_tx_pcs_bonding_dft_val dft_0
set_component_parameter_value hssi_8g_tx_pcs_bypass_pipeline_reg dis_bypass_pipeline
set_component_parameter_value hssi_8g_tx_pcs_byte_serializer dis_bs
set_component_parameter_value hssi_8g_tx_pcs_clock_gate_bs_enc en_bs_enc_clk_gating
set_component_parameter_value hssi_8g_tx_pcs_clock_gate_dw_fifowr en_dw_fifowr_clk_gating
set_component_parameter_value hssi_8g_tx_pcs_clock_gate_fiford en_fiford_clk_gating
set_component_parameter_value hssi_8g_tx_pcs_clock_gate_sw_fifowr en_sw_fifowr_clk_gating
set_component_parameter_value hssi_8g_tx_pcs_clock_observation_in_pld_core internal_refclk_b
set_component_parameter_value hssi_8g_tx_pcs_ctrl_plane_bonding_compensation dis_compensation
set_component_parameter_value hssi_8g_tx_pcs_ctrl_plane_bonding_consumption individual
set_component_parameter_value hssi_8g_tx_pcs_ctrl_plane_bonding_distribution not_master_chnl_distr
set_component_parameter_value hssi_8g_tx_pcs_data_selection_8b10b_encoder_input normal_data_path
set_component_parameter_value hssi_8g_tx_pcs_dynamic_clk_switch dis_dyn_clk_switch
set_component_parameter_value hssi_8g_tx_pcs_eightb_tenb_disp_ctrl dis_disp_ctrl
set_component_parameter_value hssi_8g_tx_pcs_eightb_tenb_encoder en_8b10b_ibm
set_component_parameter_value hssi_8g_tx_pcs_force_echar dis_force_echar
set_component_parameter_value hssi_8g_tx_pcs_force_kchar dis_force_kchar
set_component_parameter_value hssi_8g_tx_pcs_gen3_tx_clk_sel dis_tx_clk
set_component_parameter_value hssi_8g_tx_pcs_gen3_tx_pipe_clk_sel dis_tx_pipe_clk
set_component_parameter_value hssi_8g_tx_pcs_hip_mode dis_hip
set_component_parameter_value hssi_8g_tx_pcs_pcs_bypass dis_pcs_bypass
set_component_parameter_value hssi_8g_tx_pcs_phase_comp_rdptr disable_rdptr
set_component_parameter_value hssi_8g_tx_pcs_phase_compensation_fifo low_latency
set_component_parameter_value hssi_8g_tx_pcs_phfifo_write_clk_sel pld_tx_clk
set_component_parameter_value hssi_8g_tx_pcs_pma_dw ten_bit
set_component_parameter_value hssi_8g_tx_pcs_prot_mode disabled_prot_mode
set_component_parameter_value hssi_8g_tx_pcs_refclk_b_clk_sel tx_pma_clock
set_component_parameter_value hssi_8g_tx_pcs_revloop_back_rm dis_rev_loopback_rx_rm
set_component_parameter_value hssi_8g_tx_pcs_sup_mode user_mode
set_component_parameter_value hssi_8g_tx_pcs_symbol_swap dis_symbol_swap
set_component_parameter_value hssi_8g_tx_pcs_tx_bitslip dis_tx_bitslip
set_component_parameter_value hssi_8g_tx_pcs_tx_compliance_controlled_disparity dis_txcompliance
set_component_parameter_value hssi_8g_tx_pcs_tx_fast_pld_reg dis_tx_fast_pld_reg
set_component_parameter_value hssi_8g_tx_pcs_txclk_freerun en_freerun_tx
set_component_parameter_value hssi_8g_tx_pcs_txpcs_urst en_txpcs_urst
set_component_parameter_value hssi_8g_tx_pcs_silicon_rev 20nm5es
set_component_parameter_value hssi_8g_tx_pcs_reconfig_settings {{}}
set_component_parameter_value hssi_tx_pld_pcs_interface_hd_chnl_hip_en disable
set_component_parameter_value hssi_tx_pld_pcs_interface_hd_chnl_hrdrstctl_en disable
set_component_parameter_value hssi_tx_pld_pcs_interface_hd_chnl_prot_mode_tx interlaken_tx
set_component_parameter_value hssi_tx_pld_pcs_interface_hd_chnl_ctrl_plane_bonding_tx individual_tx
set_component_parameter_value hssi_tx_pld_pcs_interface_hd_chnl_pma_dw_tx pma_40b_tx
set_component_parameter_value hssi_tx_pld_pcs_interface_hd_chnl_pld_fifo_mode_tx fifo_tx
set_component_parameter_value hssi_tx_pld_pcs_interface_hd_chnl_shared_fifo_width_tx single_tx
set_component_parameter_value hssi_tx_pld_pcs_interface_hd_chnl_low_latency_en_tx disable
set_component_parameter_value hssi_tx_pld_pcs_interface_hd_chnl_func_mode enable
set_component_parameter_value hssi_tx_pld_pcs_interface_hd_chnl_sup_mode user_mode
set_component_parameter_value hssi_tx_pld_pcs_interface_hd_chnl_channel_operation_mode tx_rx_pair_enabled
set_component_parameter_value hssi_tx_pld_pcs_interface_hd_chnl_lpbk_en disable
set_component_parameter_value hssi_tx_pld_pcs_interface_hd_chnl_frequency_rules_en enable
set_component_parameter_value hssi_tx_pld_pcs_interface_hd_chnl_speed_grade i3
set_component_parameter_value hssi_tx_pld_pcs_interface_hd_chnl_pma_tx_clk_hz 37500000
set_component_parameter_value hssi_tx_pld_pcs_interface_hd_chnl_pld_tx_clk_hz 22388059
set_component_parameter_value hssi_tx_pld_pcs_interface_hd_chnl_pld_uhsif_tx_clk_hz 0
set_component_parameter_value hssi_tx_pld_pcs_interface_hd_chnl_hclk_clk_hz 0
set_component_parameter_value hssi_tx_pld_pcs_interface_hd_chnl_pld_pcs_refclk_dig_nonatpg_mode_clk_hz 0
set_component_parameter_value hssi_tx_pld_pcs_interface_hd_chnl_pld_8g_refclk_dig_nonatpg_mode_clk_hz 0
set_component_parameter_value hssi_tx_pld_pcs_interface_hd_chnl_pcs_tx_ac_pwr_uw_per_mhz 0
set_component_parameter_value hssi_tx_pld_pcs_interface_hd_chnl_pcs_tx_pwr_scaling_clk pma_tx_clk
set_component_parameter_value hssi_tx_pld_pcs_interface_hd_fifo_sup_mode user_mode
set_component_parameter_value hssi_tx_pld_pcs_interface_hd_fifo_channel_operation_mode tx_rx_pair_enabled
set_component_parameter_value hssi_tx_pld_pcs_interface_hd_fifo_prot_mode_tx teng_mode_tx
set_component_parameter_value hssi_tx_pld_pcs_interface_hd_fifo_shared_fifo_width_tx single_tx
set_component_parameter_value hssi_tx_pld_pcs_interface_hd_10g_sup_mode user_mode
set_component_parameter_value hssi_tx_pld_pcs_interface_hd_10g_channel_operation_mode tx_rx_pair_enabled
set_component_parameter_value hssi_tx_pld_pcs_interface_hd_10g_lpbk_en disable
set_component_parameter_value hssi_tx_pld_pcs_interface_hd_10g_advanced_user_mode_tx enable
set_component_parameter_value hssi_tx_pld_pcs_interface_hd_10g_pma_dw_tx pma_40b_tx
set_component_parameter_value hssi_tx_pld_pcs_interface_hd_10g_fifo_mode_tx fifo_tx
set_component_parameter_value hssi_tx_pld_pcs_interface_hd_10g_prot_mode_tx interlaken_mode_tx
set_component_parameter_value hssi_tx_pld_pcs_interface_hd_10g_ctrl_plane_bonding_tx individual_tx
set_component_parameter_value hssi_tx_pld_pcs_interface_hd_10g_low_latency_en_tx disable
set_component_parameter_value hssi_tx_pld_pcs_interface_hd_10g_shared_fifo_width_tx single_tx
set_component_parameter_value hssi_tx_pld_pcs_interface_hd_8g_sup_mode user_mode
set_component_parameter_value hssi_tx_pld_pcs_interface_hd_8g_channel_operation_mode tx_rx_pair_enabled
set_component_parameter_value hssi_tx_pld_pcs_interface_hd_8g_lpbk_en disable
set_component_parameter_value hssi_tx_pld_pcs_interface_hd_8g_prot_mode_tx disabled_prot_mode_tx
set_component_parameter_value hssi_tx_pld_pcs_interface_hd_8g_hip_mode disable
set_component_parameter_value hssi_tx_pld_pcs_interface_hd_8g_ctrl_plane_bonding_tx ctrl_master_tx
set_component_parameter_value hssi_tx_pld_pcs_interface_hd_8g_pma_dw_tx pma_10b_tx
set_component_parameter_value hssi_tx_pld_pcs_interface_hd_8g_fifo_mode_tx fifo_tx
set_component_parameter_value hssi_tx_pld_pcs_interface_hd_g3_sup_mode user_mode
set_component_parameter_value hssi_tx_pld_pcs_interface_hd_g3_prot_mode disabled_prot_mode
set_component_parameter_value hssi_tx_pld_pcs_interface_hd_krfec_sup_mode user_mode
set_component_parameter_value hssi_tx_pld_pcs_interface_hd_krfec_channel_operation_mode tx_rx_pair_enabled
set_component_parameter_value hssi_tx_pld_pcs_interface_hd_krfec_lpbk_en disable
set_component_parameter_value hssi_tx_pld_pcs_interface_hd_krfec_prot_mode_tx disabled_prot_mode_tx
set_component_parameter_value hssi_tx_pld_pcs_interface_hd_krfec_low_latency_en_tx disable
set_component_parameter_value hssi_tx_pld_pcs_interface_hd_pmaif_sup_mode user_mode
set_component_parameter_value hssi_tx_pld_pcs_interface_hd_pmaif_lpbk_en disable
set_component_parameter_value hssi_tx_pld_pcs_interface_hd_pmaif_channel_operation_mode tx_rx_pair_enabled
set_component_parameter_value hssi_tx_pld_pcs_interface_hd_pmaif_sim_mode disable
set_component_parameter_value hssi_tx_pld_pcs_interface_hd_pmaif_prot_mode_tx teng_krfec_mode_tx
set_component_parameter_value hssi_tx_pld_pcs_interface_hd_pmaif_ctrl_plane_bonding individual
set_component_parameter_value hssi_tx_pld_pcs_interface_hd_pmaif_pma_dw_tx pma_40b_tx
set_component_parameter_value hssi_tx_pld_pcs_interface_hd_pldif_prot_mode_tx teng_pld_fifo_mode_tx
set_component_parameter_value hssi_tx_pld_pcs_interface_hd_pldif_hrdrstctl_en disable
set_component_parameter_value hssi_tx_pld_pcs_interface_hd_pldif_sup_mode user_mode
set_component_parameter_value hssi_tx_pld_pcs_interface_pcs_tx_clk_source teng
set_component_parameter_value hssi_tx_pld_pcs_interface_pcs_tx_data_source hip_disable
set_component_parameter_value hssi_tx_pld_pcs_interface_pcs_tx_delay1_clk_en delay1_clk_disable
set_component_parameter_value hssi_tx_pld_pcs_interface_pcs_tx_delay1_clk_sel pcs_tx_clk
set_component_parameter_value hssi_tx_pld_pcs_interface_pcs_tx_delay1_ctrl delay1_path0
set_component_parameter_value hssi_tx_pld_pcs_interface_pcs_tx_delay1_data_sel one_ff_delay
set_component_parameter_value hssi_tx_pld_pcs_interface_pcs_tx_delay2_clk_en delay2_clk_disable
set_component_parameter_value hssi_tx_pld_pcs_interface_pcs_tx_delay2_ctrl delay2_path0
set_component_parameter_value hssi_tx_pld_pcs_interface_pcs_tx_output_sel teng_output
set_component_parameter_value hssi_tx_pld_pcs_interface_silicon_rev 20nm5es
set_component_parameter_value hssi_tx_pld_pcs_interface_pcs_tx_clk_out_sel teng_clk_out
set_component_parameter_value hssi_tx_pld_pcs_interface_reconfig_settings {{}}
set_component_parameter_value hssi_rx_pld_pcs_interface_hd_chnl_hip_en disable
set_component_parameter_value hssi_rx_pld_pcs_interface_hd_chnl_transparent_pcs_rx disable
set_component_parameter_value hssi_rx_pld_pcs_interface_hd_chnl_hrdrstctl_en disable
set_component_parameter_value hssi_rx_pld_pcs_interface_hd_chnl_prot_mode_rx interlaken_rx
set_component_parameter_value hssi_rx_pld_pcs_interface_hd_chnl_ctrl_plane_bonding_rx individual_rx
set_component_parameter_value hssi_rx_pld_pcs_interface_hd_chnl_pma_dw_rx pma_40b_rx
set_component_parameter_value hssi_rx_pld_pcs_interface_hd_chnl_pld_fifo_mode_rx fifo_rx
set_component_parameter_value hssi_rx_pld_pcs_interface_hd_chnl_shared_fifo_width_rx single_rx
set_component_parameter_value hssi_rx_pld_pcs_interface_hd_chnl_low_latency_en_rx disable
set_component_parameter_value hssi_rx_pld_pcs_interface_hd_chnl_func_mode enable
set_component_parameter_value hssi_rx_pld_pcs_interface_hd_chnl_sup_mode user_mode
set_component_parameter_value hssi_rx_pld_pcs_interface_hd_chnl_channel_operation_mode tx_rx_pair_enabled
set_component_parameter_value hssi_rx_pld_pcs_interface_hd_chnl_lpbk_en disable
set_component_parameter_value hssi_rx_pld_pcs_interface_hd_10g_advanced_user_mode_rx disable
set_component_parameter_value hssi_rx_pld_pcs_interface_hd_chnl_frequency_rules_en enable
set_component_parameter_value hssi_rx_pld_pcs_interface_hd_chnl_speed_grade i3
set_component_parameter_value hssi_rx_pld_pcs_interface_hd_chnl_pma_rx_clk_hz 37500000
set_component_parameter_value hssi_rx_pld_pcs_interface_hd_chnl_pld_rx_clk_hz 22388059
set_component_parameter_value hssi_rx_pld_pcs_interface_hd_chnl_fref_clk_hz 125000000
set_component_parameter_value hssi_rx_pld_pcs_interface_hd_chnl_clklow_clk_hz 125000000
set_component_parameter_value hssi_rx_pld_pcs_interface_hd_chnl_hclk_clk_hz 0
set_component_parameter_value hssi_rx_pld_pcs_interface_hd_chnl_pld_pcs_refclk_dig_nonatpg_mode_clk_hz 0
set_component_parameter_value hssi_rx_pld_pcs_interface_hd_chnl_pld_8g_refclk_dig_nonatpg_mode_clk_hz 0
set_component_parameter_value hssi_rx_pld_pcs_interface_hd_chnl_pcs_rx_ac_pwr_uw_per_mhz 0
set_component_parameter_value hssi_rx_pld_pcs_interface_hd_chnl_operating_voltage standard
set_component_parameter_value hssi_rx_pld_pcs_interface_hd_chnl_pcs_ac_pwr_rules_en disable
set_component_parameter_value hssi_rx_pld_pcs_interface_hd_chnl_pcs_rx_pwr_scaling_clk pma_rx_clk
set_component_parameter_value hssi_rx_pld_pcs_interface_hd_chnl_pcs_pair_ac_pwr_uw_per_mhz 0
set_component_parameter_value hssi_rx_pld_pcs_interface_hd_fifo_sup_mode user_mode
set_component_parameter_value hssi_rx_pld_pcs_interface_hd_fifo_channel_operation_mode tx_rx_pair_enabled
set_component_parameter_value hssi_rx_pld_pcs_interface_hd_fifo_prot_mode_rx teng_mode_rx
set_component_parameter_value hssi_rx_pld_pcs_interface_hd_fifo_shared_fifo_width_rx single_rx
set_component_parameter_value hssi_rx_pld_pcs_interface_hd_10g_sup_mode user_mode
set_component_parameter_value hssi_rx_pld_pcs_interface_hd_10g_channel_operation_mode tx_rx_pair_enabled
set_component_parameter_value hssi_rx_pld_pcs_interface_hd_10g_lpbk_en disable
set_component_parameter_value hssi_rx_pld_pcs_interface_hd_10g_pma_dw_rx pma_40b_rx
set_component_parameter_value hssi_rx_pld_pcs_interface_hd_10g_fifo_mode_rx fifo_rx
set_component_parameter_value hssi_rx_pld_pcs_interface_hd_10g_prot_mode_rx interlaken_mode_rx
set_component_parameter_value hssi_rx_pld_pcs_interface_hd_10g_ctrl_plane_bonding_rx individual_rx
set_component_parameter_value hssi_rx_pld_pcs_interface_hd_10g_low_latency_en_rx disable
set_component_parameter_value hssi_rx_pld_pcs_interface_hd_10g_shared_fifo_width_rx single_rx
set_component_parameter_value hssi_rx_pld_pcs_interface_hd_10g_test_bus_mode rx
set_component_parameter_value hssi_rx_pld_pcs_interface_hd_8g_sup_mode user_mode
set_component_parameter_value hssi_rx_pld_pcs_interface_hd_8g_channel_operation_mode tx_rx_pair_enabled
set_component_parameter_value hssi_rx_pld_pcs_interface_hd_8g_lpbk_en disable
set_component_parameter_value hssi_rx_pld_pcs_interface_hd_8g_prot_mode_rx disabled_prot_mode_rx
set_component_parameter_value hssi_rx_pld_pcs_interface_hd_8g_hip_mode disable
set_component_parameter_value hssi_rx_pld_pcs_interface_hd_8g_ctrl_plane_bonding_rx individual_rx
set_component_parameter_value hssi_rx_pld_pcs_interface_hd_8g_pma_dw_rx pma_10b_rx
set_component_parameter_value hssi_rx_pld_pcs_interface_hd_8g_fifo_mode_rx fifo_rx
set_component_parameter_value hssi_rx_pld_pcs_interface_hd_g3_sup_mode user_mode
set_component_parameter_value hssi_rx_pld_pcs_interface_hd_g3_prot_mode disabled_prot_mode
set_component_parameter_value hssi_rx_pld_pcs_interface_hd_krfec_sup_mode user_mode
set_component_parameter_value hssi_rx_pld_pcs_interface_hd_krfec_channel_operation_mode tx_rx_pair_enabled
set_component_parameter_value hssi_rx_pld_pcs_interface_hd_krfec_lpbk_en disable
set_component_parameter_value hssi_rx_pld_pcs_interface_hd_krfec_prot_mode_rx disabled_prot_mode_rx
set_component_parameter_value hssi_rx_pld_pcs_interface_hd_krfec_low_latency_en_rx disable
set_component_parameter_value hssi_rx_pld_pcs_interface_hd_krfec_test_bus_mode tx
set_component_parameter_value hssi_rx_pld_pcs_interface_hd_pmaif_sup_mode user_mode
set_component_parameter_value hssi_rx_pld_pcs_interface_hd_pmaif_lpbk_en disable
set_component_parameter_value hssi_rx_pld_pcs_interface_hd_pmaif_channel_operation_mode tx_rx_pair_enabled
set_component_parameter_value hssi_rx_pld_pcs_interface_hd_pmaif_sim_mode disable
set_component_parameter_value hssi_rx_pld_pcs_interface_hd_pmaif_prot_mode_rx teng_krfec_mode_rx
set_component_parameter_value hssi_rx_pld_pcs_interface_hd_pmaif_pma_dw_rx pma_40b_rx
set_component_parameter_value hssi_rx_pld_pcs_interface_hd_pldif_prot_mode_rx teng_pld_fifo_mode_rx
set_component_parameter_value hssi_rx_pld_pcs_interface_hd_pldif_hrdrstctl_en disable
set_component_parameter_value hssi_rx_pld_pcs_interface_hd_pldif_sup_mode user_mode
set_component_parameter_value hssi_rx_pld_pcs_interface_pcs_rx_block_sel teng
set_component_parameter_value hssi_rx_pld_pcs_interface_pcs_rx_clk_sel pld_rx_clk
set_component_parameter_value hssi_rx_pld_pcs_interface_pcs_rx_hip_clk_en hip_rx_disable
set_component_parameter_value hssi_rx_pld_pcs_interface_pcs_rx_output_sel teng_output
set_component_parameter_value hssi_rx_pld_pcs_interface_silicon_rev 20nm5es
set_component_parameter_value hssi_rx_pld_pcs_interface_pcs_rx_clk_out_sel teng_clk_out
set_component_parameter_value hssi_rx_pld_pcs_interface_reconfig_settings {{}}
set_component_parameter_value hssi_common_pld_pcs_interface_dft_clk_out_en dft_clk_out_disable
set_component_parameter_value hssi_common_pld_pcs_interface_dft_clk_out_sel teng_rx_dft_clk
set_component_parameter_value hssi_common_pld_pcs_interface_hrdrstctrl_en hrst_dis
